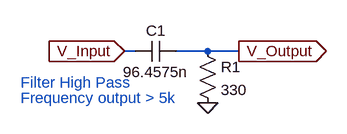
[diagram p0: schematic High_Pass_5k.asc]
High_Pass_5k.asc, the LTspice schematic file:
Version 4
SHEET 1 880 680
WIRE 32 160 16 160
WIRE 144 160 96 160
WIRE 192 160 144 160
FLAG 16 160 V_Input
IOPIN 16 160 In
FLAG 144 240 0
FLAG 192 160 V_Output
IOPIN 192 160 Out
SYMBOL cap 96 144 R90
WINDOW 0 0 32 VBottom 2
WINDOW 3 32 32 VTop 2
SYMATTR InstName C1
SYMATTR Value 96.4575n
SYMBOL res 128 144 R0
SYMATTR InstName R1
SYMATTR Value 330
TEXT -144 208 Left 2 ;Filter High Pass
TEXT -144 232 Left 2 ;Frequency output > 5k

The netlist it stands for:
* High_Pass_5k.asc
C1 V_Output V_Input 96.4575n
R1 V_Output 0 330
* Filter High Pass
* Frequency output > 5k
.backanno
.end